# Altium schematic sheet lv_io_pressure.SchDoc
size A4; Organization: Badgerloop; Address1: 133 Engineering Research; Address2: Building; Address3: Madison, WI 53715
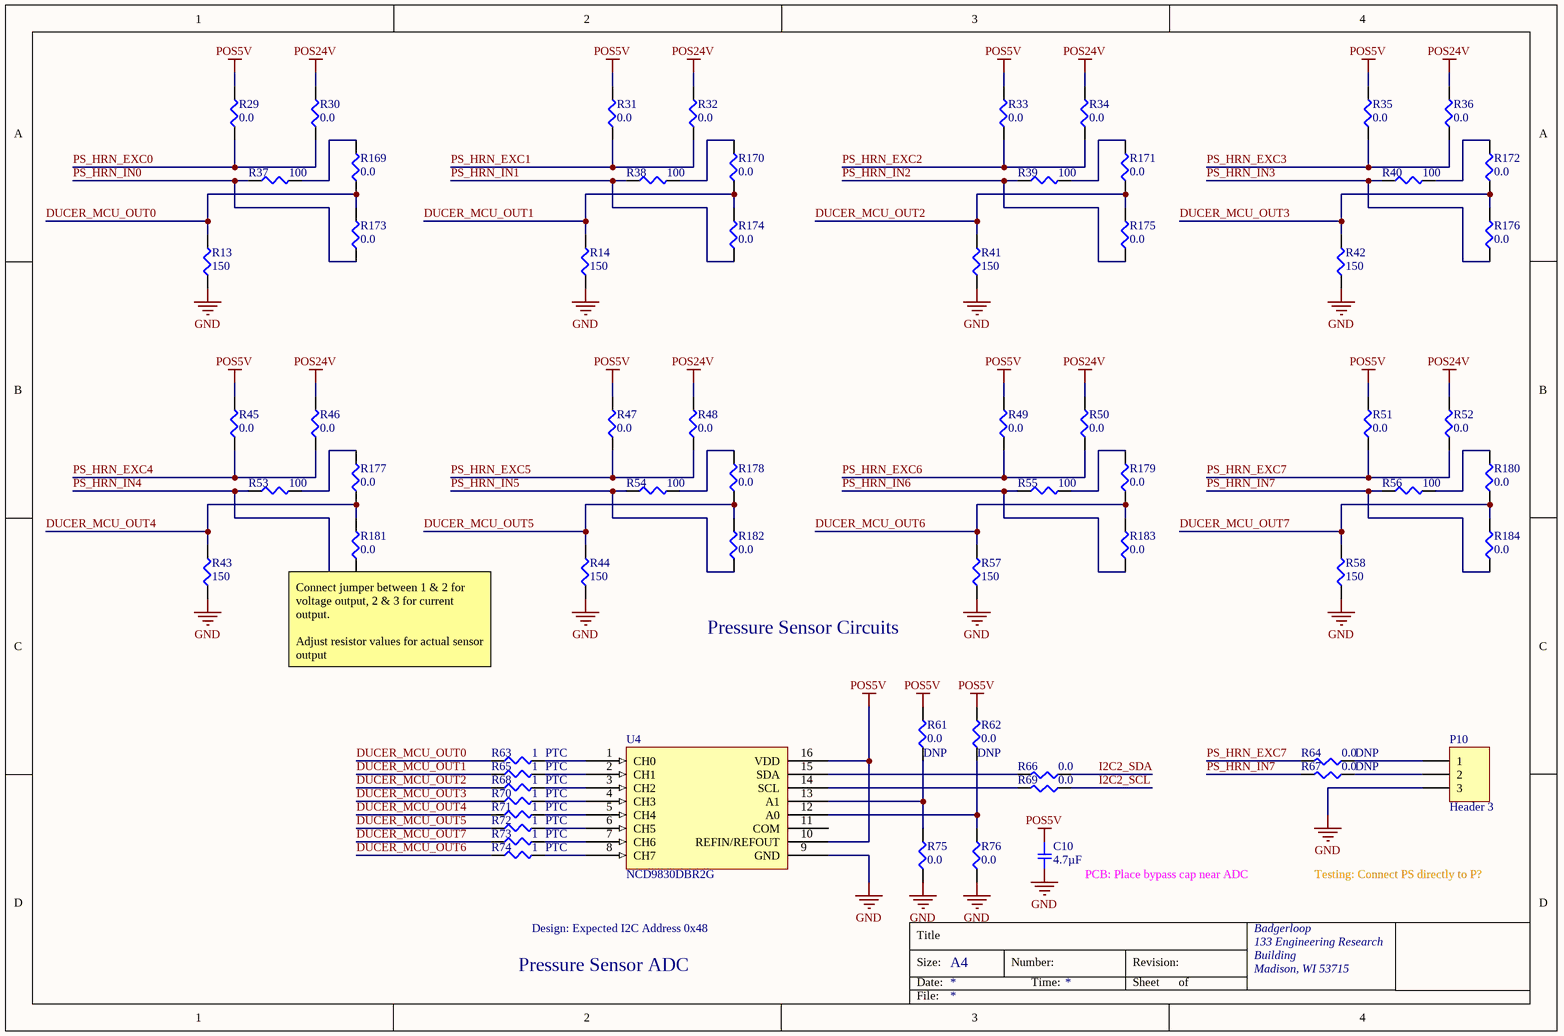
[diagram p0: lv_io_pressure.SchDoc]

## Parts
C10  4.7µF  [SMD-0805C]
P10  Header 3  [Pin Header 1x3 TH Pitch 2.54mm]
R13  150  [SMD-0402-RES]
R14  150  [SMD-0402-RES]
R29  0.0  [SMD-0402-RES]
R30  0.0  [SMD-0402-RES]
R31  0.0  [SMD-0402-RES]
R32  0.0  [SMD-0402-RES]
R33  0.0  [SMD-0402-RES]
R34  0.0  [SMD-0402-RES]
R35  0.0  [SMD-0402-RES]
R36  0.0  [SMD-0402-RES]
R37  100  [SMD-0402-RES]
R38  100  [SMD-0402-RES]
R39  100  [SMD-0402-RES]
R40  100  [SMD-0402-RES]
R41  150  [SMD-0402-RES]
R42  150  [SMD-0402-RES]
R43  150  [SMD-0402-RES]
R44  150  [SMD-0402-RES]
R45  0.0  [SMD-0402-RES]
R46  0.0  [SMD-0402-RES]
R47  0.0  [SMD-0402-RES]
R48  0.0  [SMD-0402-RES]
R49  0.0  [SMD-0402-RES]
R50  0.0  [SMD-0402-RES]
R51  0.0  [SMD-0402-RES]
R52  0.0  [SMD-0402-RES]
R53  100  [SMD-0402-RES]
R54  100  [SMD-0402-RES]
R55  100  [SMD-0402-RES]
R56  100  [SMD-0402-RES]
R57  150  [SMD-0402-RES]
R58  150  [SMD-0402-RES]
R61  0.0  [SMD-0402-RES]
R62  0.0  [SMD-0402-RES]
R63  1  Features: PTC  [SMD-0603-RES]
R64  0.0  [SMD-0402-RES]
R65  1  Features: PTC  [SMD-0603-RES]
R66  0.0  [SMD-0402-RES]
R67  0.0  [SMD-0402-RES]
R68  1  Features: PTC  [SMD-0603-RES]
R69  0.0  [SMD-0402-RES]
R70  1  Features: PTC  [SMD-0603-RES]
R71  1  Features: PTC  [SMD-0603-RES]
R72  1  Features: PTC  [SMD-0603-RES]
R73  1  Features: PTC  [SMD-0603-RES]
R74  1  Features: PTC  [SMD-0603-RES]
R75  0.0  [SMD-0402-RES]
R76  0.0  [SMD-0402-RES]
R169  0.0  [SMD-0402-RES]
R170  0.0  [SMD-0402-RES]
R171  0.0  [SMD-0402-RES]
R172  0.0  [SMD-0402-RES]
R173  0.0  [SMD-0402-RES]
R174  0.0  [SMD-0402-RES]
R175  0.0  [SMD-0402-RES]
R176  0.0  [SMD-0402-RES]
R177  0.0  [SMD-0402-RES]
R178  0.0  [SMD-0402-RES]
R179  0.0  [SMD-0402-RES]
R180  0.0  [SMD-0402-RES]
R181  0.0  [SMD-0402-RES]
R182  0.0  [SMD-0402-RES]
R183  0.0  [SMD-0402-RES]
R184  0.0  [SMD-0402-RES]
U4  NCD9830DBR2G  [TSOP65P640X120_HS-17N]

## Nets
GND: C10.2 P10.3 R13.1 R14.1 R41.1 R42.1 R43.1 R44.1 R57.1 R58.1 R75.1 R76.1 U4.9(GND)
POS5V: C10.1 R29.2 R31.2 R33.2 R35.2 R45.2 R47.2 R49.2 R51.2 R61.2 R62.2 U4.10(REFIN/REFOUT) U4.16(VDD)
POS24V: R30.2 R32.2 R34.2 R36.2 R46.2 R48.2 R50.2 R52.2
DUCER_MCU_OUT0: R13.2 R63.1 R169.1 R173.2
DUCER_MCU_OUT1: R14.2 R65.1 R170.1 R174.2
DUCER_MCU_OUT2: R41.2 R68.1 R171.1 R175.2
DUCER_MCU_OUT3: R42.2 R70.1 R172.1 R176.2
DUCER_MCU_OUT4: R43.2 R71.1 R177.1 R181.2
DUCER_MCU_OUT5: R44.2 R72.1 R178.1 R182.2
DUCER_MCU_OUT6: R57.2 R74.1 R179.1 R183.2
DUCER_MCU_OUT7: R58.2 R73.1 R180.1 R184.2
I2C2_SCL: R69.1
I2C2_SDA: R66.1
PS_HRN_EXC0: R29.1 R30.1
PS_HRN_EXC1: R31.1 R32.1
PS_HRN_EXC2: R33.1 R34.1
PS_HRN_EXC3: R35.1 R36.1
PS_HRN_EXC4: R45.1 R46.1
PS_HRN_EXC5: R47.1 R48.1
PS_HRN_EXC6: R49.1 R50.1
PS_HRN_EXC7: R51.1 R52.1 R64.2
PS_HRN_IN0: R37.1 R173.1
PS_HRN_IN1: R38.1 R174.1
PS_HRN_IN2: R39.1 R175.1
PS_HRN_IN3: R40.1 R176.1
PS_HRN_IN4: R53.1 R181.1
PS_HRN_IN5: R54.1 R182.1
PS_HRN_IN6: R55.1 R183.1
PS_HRN_IN7: R56.1 R67.2 R184.1
NetP10_1: P10.1 R64.1
NetP10_2: P10.2 R67.1
NetR37_2: R37.2 R169.2
NetR38_2: R38.2 R170.2
NetR39_2: R39.2 R171.2
NetR40_2: R40.2 R172.2
NetR53_2: R53.2 R177.2
NetR54_2: R54.2 R178.2
NetR55_2: R55.2 R179.2
NetR56_2: R56.2 R180.2
NetR61_1: R61.1 R75.2 U4.13(A1)
NetR62_1: R62.1 R76.2 U4.12(A0)
NetR63_2: R63.2 U4.1(CH0)
NetR65_2: R65.2 U4.2(CH1)
NetR66_2: R66.2 U4.15(SDA)
NetR68_2: R68.2 U4.3(CH2)
NetR69_2: R69.2 U4.14(SCL)
NetR70_2: R70.2 U4.4(CH3)
NetR71_2: R71.2 U4.5(CH4)
NetR72_2: R72.2 U4.6(CH5)
NetR73_2: R73.2 U4.7(CH6)
NetR74_2: R74.2 U4.8(CH7)

Not connected (* = marked no-connect by the designer): U4 11(COM)

## Notes on the sheet
- Pressure Sensor Circuits
- (near R181) Connect jumper between 1 & 2 for voltage output, 2 & 3 for current output.
  Adjust resistor values for actual sensor output
- (near C10) PCB: Place bypass cap near ADC
- Testing: Connect PS directly to P?
- Pressure Sensor ADC
- Design: Expected I2C Address 0x48
- Title
- Size:
- Date:
- A4
- Number:
- Time:
- Revision:
- Sheet
- of
- File:

## Library data of the parts
C10 = GRM21BR60J475KA11L: CAP CER 4.7UF 6.3V X5R 0805; Manufacturer: Murata Electronics North America; Factory Stock: 0; Unit Price (USD): 0.28; Minimum Quantity: 1; Tolerance: ±10%; Datasheets: http://www.murata.com/~/media/webrenewal/support/library/catalog/products/capacitor/mlcc/c02e.pdf; Image: //media.digikey.com/Renders/Murata%20Renders/0805%20(2012%20Metric)%20.85mm.jpg; Digi-Key Part Number: 490-9749-1-ND; Part Number: GRM21BR60J475KA11L; Quantity Available: 2821; @ qty: 0; Packaging: Cut Tape (CT); Series: GRM; Part Status: Active; Value: 4.7µF; Voltage: 6.3V; Temperature Coefficient: X5R; Operating Temperature: -55°C ~ 85°C; Features: -; Ratings: -; Applications: General Purpose; Mounting Type: Surface Mount, MLCC; Package / Case: 0805 (2012 Metric); Size / Dimension: 0.079" L x 0.049" W (2.00mm x 1.25mm); Height - Seated (Max): -; Thickness (Max): 0.055" (1.40mm); Lead Spacing: -; Lead Style: -
P10 = Header 3: Header, 3-Pin; LatestRevisionDate: 17-Jul-2002; LatestRevisionNote: Re-released for DXP Platform.; Publisher: Altium Limited
R13 R14 R41-R44 R57 R58 = ERJ-2GEJ151X: RES SMD 150 OHM 5% 1/10W 0402; Manufacturer: Panasonic Electronic Components; Factory Stock: 0; Unit Price (USD): 0.00350; @ qty: 1500; Minimum Quantity: 1; Power (Watts): 0.1W, 1/10W; Temperature Coefficient: ±200ppm/°C; Part Number: ERJ-2GEJ151X; Datasheets: http://industrial.panasonic.com/www-cgi/jvcr13pz.cgi?E+PZ+3+AOA0001+ERJ2GEJ151X+7+WW; Image: //media.digikey.com/Photos/Panasonic%20Photos/ERJ-PA2-Series.jpg; Digi-Key Part Number: P150JCT-ND; Quantity Available: 303213; Packaging: Cut Tape (CT); Series: ERJ; Part Status: Active; Value: 150; Tolerance: ±5%; Composition: Thick Film; Features: Automotive AEC-Q200; Operating Temperature: -55°C ~ 155°C; Package / Case: 0402 (1005 Metric); Supplier Device Package: 0402; Size / Dimension: 0.039" L x 0.020" W (1.00mm x 0.50mm); Height - Seated (Max): 0.016" (0.40mm); Number of Terminations: 2; Failure Rate: -
R29-R36 R45-R52 R61 R62 R64 R66 R67 R69 R75 R76 R169-R184 = ERJ-2GE0R00X: RES SMD 0.0OHM JUMPER 1/10W 0402; Manufacturer: Panasonic Electronic Components; Factory Stock: 0; Unit Price (USD): 0.00384; @ qty: 1500; Minimum Quantity: 1; Power (Watts): 0.1W, 1/10W; Part Number: ERJ-2GE0R00X; Datasheets: http://industrial.panasonic.com/www-cgi/jvcr13pz.cgi?E+PZ+3+AOA0001+ERJ2GE0R00X+7+WW; Image: //media.digikey.com/Photos/Panasonic%20Photos/ERJ-PA2-Series.jpg; Digi-Key Part Number: P0.0JCT-ND; Quantity Available: 3152483; Packaging: Cut Tape (CT); Series: ERJ; Part Status: Active; Value: 0.0; Tolerance: Jumper; Composition: Thick Film; Features: Automotive AEC-Q200; Temperature Coefficient: -; Operating Temperature: -55°C ~ 155°C; Package / Case: 0402 (1005 Metric); Supplier Device Package: 0402; Size / Dimension: 0.039" L x 0.020" W (1.00mm x 0.50mm); Height - Seated (Max): 0.016" (0.40mm); Number of Terminations: 2; Failure Rate: -
  R61 R62 R64 R67: DNP: DNP
R37-R40 R53-R56 = ERJ-2GEJ101X: RES SMD 100 OHM 5% 1/10W 0402; Manufacturer: Panasonic Electronic Components; Factory Stock: 0; Unit Price (USD): 0.00350; @ qty: 1500; Minimum Quantity: 1; Power (Watts): 0.1W, 1/10W; Temperature Coefficient: ±200ppm/°C; Part Number: ERJ-2GEJ101X; Datasheets: http://industrial.panasonic.com/www-cgi/jvcr13pz.cgi?E+PZ+3+AOA0001+ERJ2GEJ101X+7+WW; Image: //media.digikey.com/Photos/Panasonic%20Photos/ERJ-PA2-Series.jpg; Digi-Key Part Number: P100JCT-ND; Quantity Available: 3114113; Packaging: Cut Tape (CT); Series: ERJ; Part Status: Active; Value: 100; Tolerance: ±5%; Composition: Thick Film; Features: Automotive AEC-Q200; Operating Temperature: -55°C ~ 155°C; Package / Case: 0402 (1005 Metric); Supplier Device Package: 0402; Size / Dimension: 0.039" L x 0.020" W (1.00mm x 0.50mm); Height - Seated (Max): 0.016" (0.40mm); Number of Terminations: 2; Failure Rate: -
R63 R65 R68 R70-R74 = PRG18BB470MB1RB: PTC RESET FUSE 6V 330MA 0603; Manufacturer P/N: PRG18BC1R0MM1RB; Manufacturer: Murata; Factory Stock: 0; Unit Price (USD): 0.10080; @ qty: 1500; Tolerance: ±1%; Power (Watts): 0.167W, 1/6W; Temperature Coefficient: ±250ppm/°C; Digikey Link: https://www.digikey.com/product-detail/en/murata-electronics-north-america/PRG18BC1R0MM1RB/490-8505-1-ND/4380768; Image: //media.digikey.com/Photos/Panasonic%20Photos/ERJ-PA2-Series.jpg; Digi-Key Part Number: 490-8505-1-ND; Quantity Available: 14922; Minimum Quantity: 1; Packaging: Cut Tape (CT); Part Status: Active; Value: 1; Composition: Thick Film; Operating Temperature: -55°C ~ 125°C; Package / Case: 0603; Supplier Device Package: 0402; Size / Dimension: 0.039" L x 0.020" W (1.00mm x 0.50mm); Height - Seated (Max): 0.016" (0.40mm); Number of Terminations: 2; Failure Rate: -
U4 = NCD9830DBR2G: IC ADC 8BIT 8CH I2C 16TSSOP; Manufacturer: ON Semiconductor; Digikey P/N: NCD9830DBR2GOSCT-ND; Digikey Link: https://www.digikey.com/product-detail/en/on-semiconductor/NCD9830DBR2G/NCD9830DBR2GOSCT-ND/9086945; Cost: 2.70; Manufacturer P/N: NCD9830DBR2G